# EAGLE design cubo (EAGLE 9.5.0)
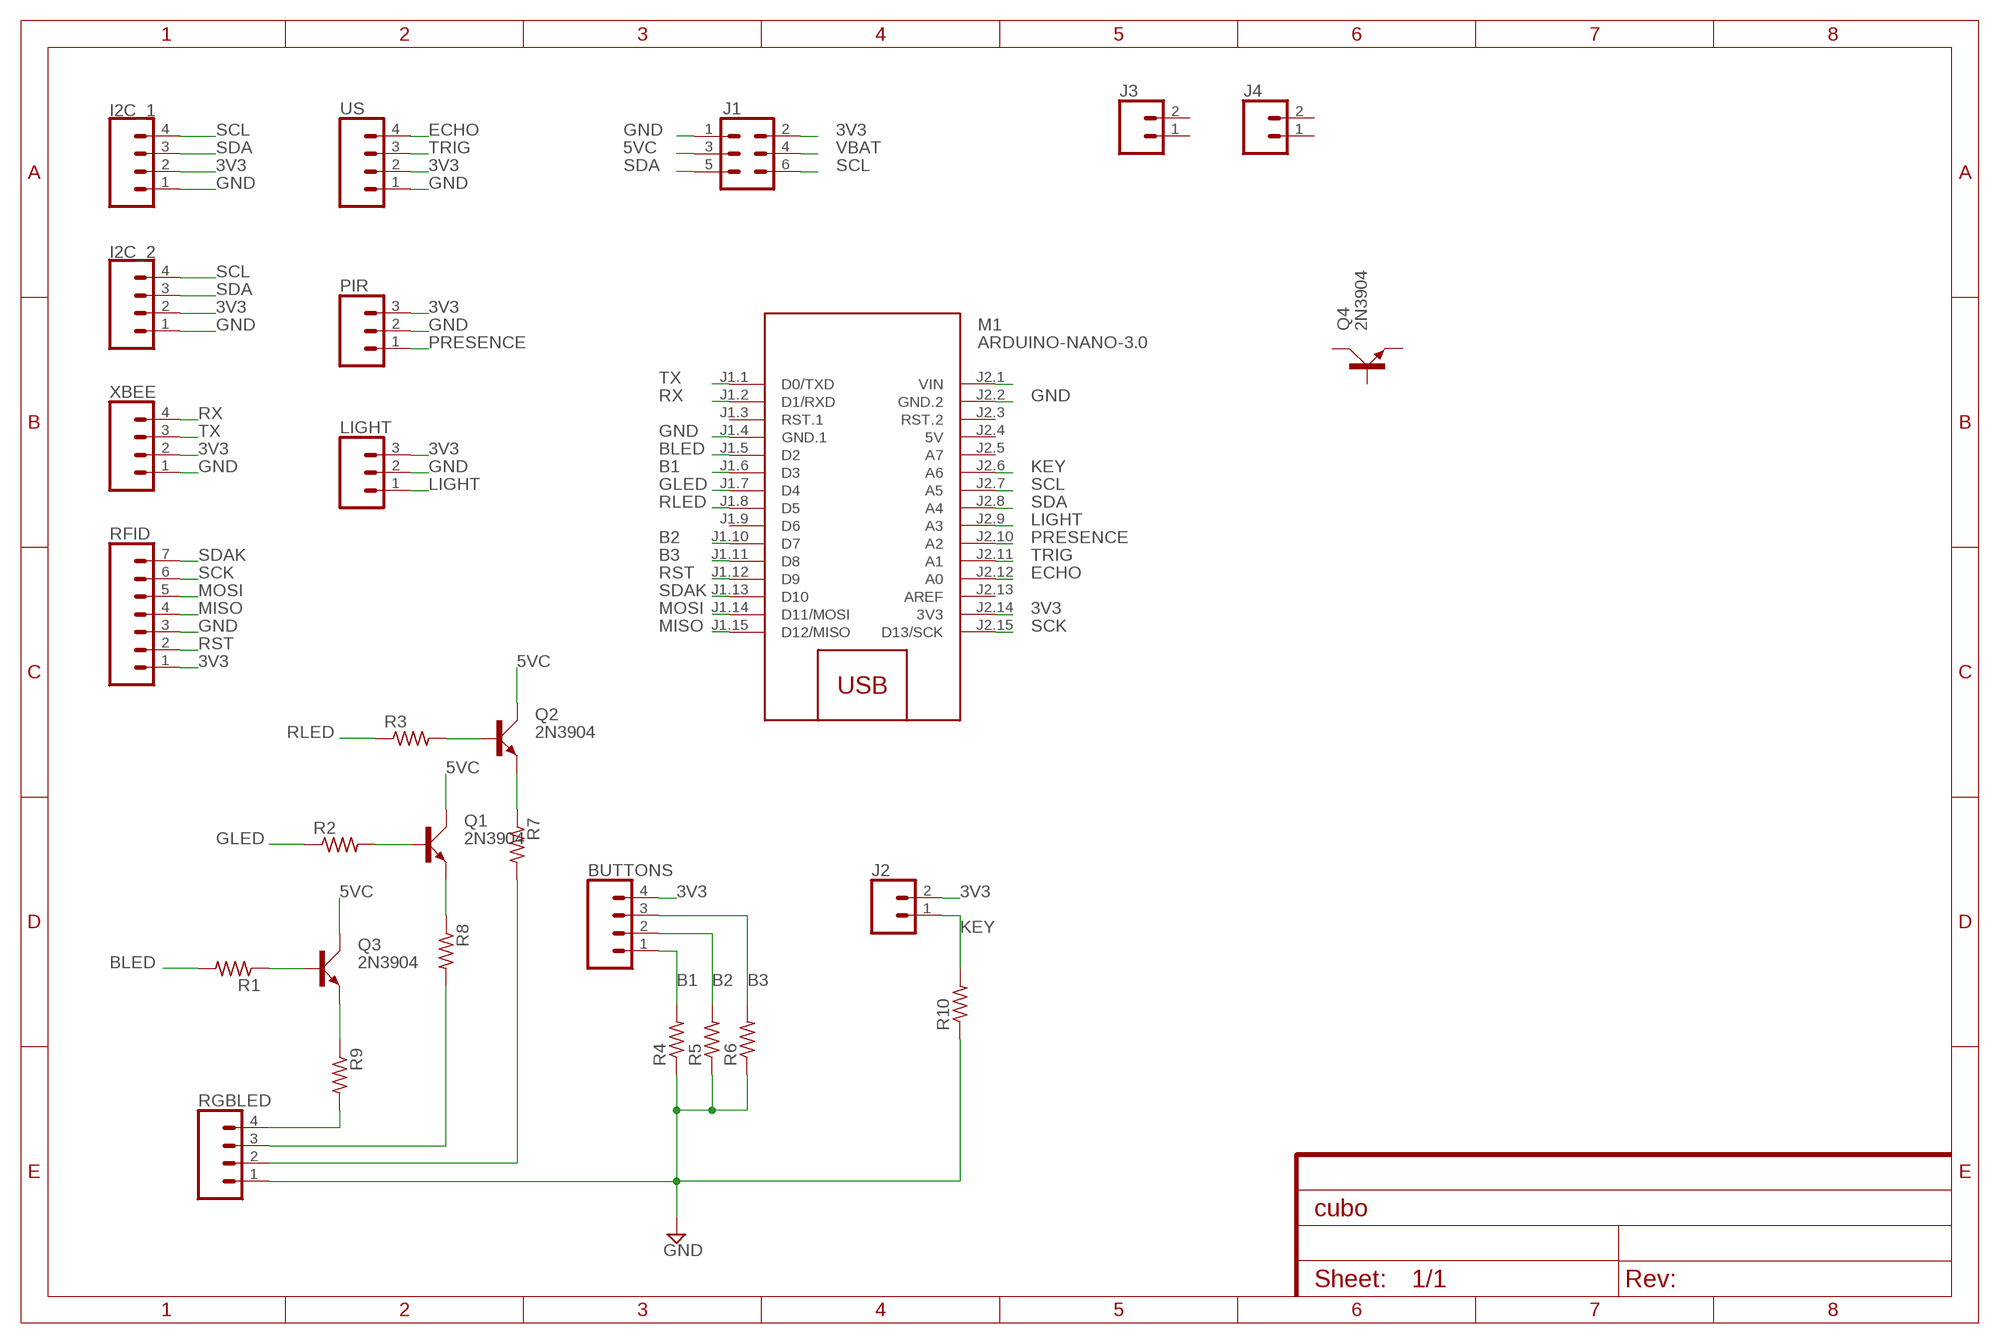
[diagram p0: schematic, sheet 1]

## Parts
BUTTONS  CONN_04JST-PTH-VERT  [JST-4-PTH-VERT]
I2C_1  CONN_04JST-PTH-VERT  [JST-4-PTH-VERT]
I2C_2  CONN_04JST-PTH-VERT  [JST-4-PTH-VERT]
J1  CONN_03X2SHROUD  [2X3-SHROUDED]
J2  CONN_02POLAR_LOCK  [MOLEX-1X2_LOCK]
J3  CONN_02POLAR_LOCK  [MOLEX-1X2_LOCK]
J4  CONN_02POLAR_LOCK  [MOLEX-1X2_LOCK]
LIGHT  CONN_03JST-PTH-VERT  [JST-3-PTH-VERT]
M1  ARDUINO-NANO-3.0  [ARDUINO-NANO-3.0]
PIR  CONN_03JST-PTH-VERT  [JST-3-PTH-VERT]
Q1  2N3904  [TO92D]
Q2  2N3904  [TO92D]
Q3  2N3904  [TO92D]
Q4  2N3904  [TO92D]
R1  R-US_0207/10  [0207/10]
R2  R-US_0207/10  [0207/10]
R3  R-US_0207/10  [0207/10]
R4  R-US_0207/10  [0207/10]
R5  R-US_0207/10  [0207/10]
R6  R-US_0207/10  [0207/10]
R7  R-US_0207/10  [0207/10]
R8  R-US_0207/10  [0207/10]
R9  R-US_0207/10  [0207/10]
R10  R-US_0207/10  [0207/10]
RFID  CONN_07  [1X07]
RGBLED  CONN_04JST-PTH-VERT  [JST-4-PTH-VERT]
US  CONN_04JST-PTH-VERT  [JST-4-PTH-VERT]
XBEE  CONN_04JST-PTH-VERT  [JST-4-PTH-VERT]

## Nets
3V3: BUTTONS.4 I2C_1.2 I2C_2.2 J1.2 J2.2 LIGHT.3 M1.J2.14(3V3) PIR.3 RFID.1 US.2 XBEE.2
5VC: J1.3 Q1.C Q2.C Q3.C
B1: BUTTONS.1 M1.J1.6(D3) R4.2
B2: BUTTONS.2 M1.J1.10(D7) R5.2
B3: BUTTONS.3 M1.J1.11(D8) R6.2
BLED: M1.J1.5(D2) R1.2
ECHO: M1.J2.12(A0) US.4
GLED: M1.J1.7(D4) R2.1
GND: I2C_1.1 I2C_2.1 J1.1 LIGHT.2 M1.J1.4(GND.1) M1.J2.2(GND.2) PIR.2 R4.1 R5.1 R6.1 R10.1 RFID.3 RGBLED.1 US.1 XBEE.1
KEY: J2.1 M1.J2.6(A6) R10.2
LIGHT: LIGHT.1 M1.J2.9(A3)
MISO: M1.J1.15(D12/MISO) RFID.4
MOSI: M1.J1.14(D11/MOSI) RFID.5
N$1: Q2.B R3.2
N$2: Q1.B R2.2
N$3: Q3.B R1.1
N$4: Q3.E R9.1
N$5: Q1.E R8.1
N$6: Q2.E R7.1
N$7: M1.J2.1(VIN)
N$13: R9.2 RGBLED.4
N$14: R8.2 RGBLED.3
N$15: R7.2 RGBLED.2
PRESENCE: M1.J2.10(A2) PIR.1
RLED: M1.J1.8(D5) R3.1
RST: M1.J1.12(D9) RFID.2
RX: M1.J1.2(D1/RXD) XBEE.4
SCK: M1.J2.15(D13/SCK) RFID.6
SCL: I2C_1.4 I2C_2.4 J1.6 M1.J2.7(A5)
SDA: I2C_1.3 I2C_2.3 J1.5 M1.J2.8(A4)
SDAK: M1.J1.13(D10) RFID.7
TRIG: M1.J2.11(A1) US.3
TX: M1.J1.1(D0/TXD) XBEE.3
VBAT: J1.4
Unconnected: J3.1 J3.2 J4.1 J4.2 M1.J1.3(RST.1) M1.J1.9(D6) M1.J2.3(RST.2) M1.J2.5(A7) M1.J2.13(AREF) Q4.B Q4.C Q4.E

## Power pins joined to a net without a drawn wire
5V: M1.J2.4(5V)

## Library data of the parts
BUTTONS I2C_1 I2C_2 RGBLED US XBEE = SparkFun-Connectors:CONN_04: Multi connection point. Often used as Generic Header-pin footprint for 0.1 inch spaced/style header connections On any of the 0.1 inch spaced packages, you can populate with these: Break Away Headers - Straight <https://www.sparkfun.com/products/116> (PRT-00116) Break Away Male Headers - Right Angle <https://www.sparkfun.com/products/553> (PRT-00553) Female Headers <https://www.sparkfun.com/products/115> (PRT-00115) Break Away Headers - Machine Pin <https://www.sparkfun.com/products/117> (PRT-00117) Break Away Female Headers - Swiss Machine Pin <https://www.sparkfun.com/products/743> (PRT-00743) For SCREWTERMINALS and SPRING TERMINALS visit here: Screw Terimnals on SparkFun.com <https://www.sparkfun.com/search/results?term=Screw+Terminals> (5mm/3.5mm/2.54mm spacing) This device is also useful as a general connection point to wire up your design to another part of your project. Our various solder wires solder well into these plated through hole pads. Hook-Up Wire - Assortment (Stranded, 22 AWG) <https://www.sparkfun.com/products/11375> (PRT-11375) Hook-Up Wire - Assortment (Solid Core, 22 AWG) <https://www.sparkfun.com/products/11367> (PRT-11367) View the entire wire category on our website here <https://www.sparkfun.com/categories/141> Special notes: Molex polarized connector foot print use with SKU : PRT-08231 with associated crimp pins and housings. 1MM SMD Version SKU: PRT-10208; PROD_ID: CONN-13251
J1 = SparkFun-Connectors:CONN_03X2: Multi connection point. Often used as Generic Header-pin footprint for 0.1 inch spaced/style header connections You can populate with any combo of single row headers, but if you'd like an exact match, check these: Header - 2x3 (Male, 0.1") <https://www.sparkfun.com/products/12807> (PRT-12807) Header - 2x3 (Female, 0.1") <https://www.sparkfun.com/products/13010> (PRT-13010) 2x3 Pin Shrouded Header <https://www.sparkfun.com/products/10877> (PRT-10877) On any of the 0.1 inch spaced packages, you can populate with these: Break Away Headers - Straight <https://www.sparkfun.com/products/116> (PRT-00116) Break Away Male Headers - Right Angle <https://www.sparkfun.com/products/553> (PRT-00553) Female Headers <https://www.sparkfun.com/products/115> (PRT-00115) Break Away Headers - Machine Pin <https://www.sparkfun.com/products/117> (PRT-00117) Break Away Female Headers - Swiss Machine Pin <https://www.sparkfun.com/products/743> (PRT-00743) Special note: the shrouded connector mates well with our 3x2 ribbon cables: Ribbon Crimp Connector - 6-pin (2x3, Female) <https://www.sparkfun.com/products/10651> (PRT-10651) Ribbon Cable - 6 wire (15ft) <https://www.sparkfun.com/products/10646> (PRT-10646); PROD_ID: CONN-10681; SF_ID: PRT_10877
J2-J4 = SparkFun-Connectors:CONN_02: Multi connection point. Often used as Generic Header-pin footprint for 0.1 inch spaced/style header connections On any of the 0.1 inch spaced packages, you can populate with these: Break Away Headers - Straight <https://www.sparkfun.com/products/116> (PRT-00116) Break Away Male Headers - Right Angle <https://www.sparkfun.com/products/553> (PRT-00553) Female Headers <https://www.sparkfun.com/products/115> (PRT-00115) Break Away Headers - Machine Pin <https://www.sparkfun.com/products/117> (PRT-00117) Break Away Female Headers - Swiss Machine Pin <https://www.sparkfun.com/products/743> (PRT-00743) For SCREWTERMINALS and SPRING TERMINALS visit here: Screw Terimnals on SparkFun.com <https://www.sparkfun.com/search/results?term=Screw+Terminals> (5mm/3.5mm/2.54mm spacing) This device is also useful as a general connection point to wire up your design to another part of your project. Our various solder wires solder well into these plated through hole pads. Hook-Up Wire - Assortment (Stranded, 22 AWG) <https://www.sparkfun.com/products/11375> (PRT-11375) Hook-Up Wire - Assortment (Solid Core, 22 AWG) <https://www.sparkfun.com/products/11367> (PRT-11367) View the entire wire category on our website here <https://www.sparkfun.com/categories/141> Special notes: Molex polarized connector foot print use with: PRT-08233 with associated crimp pins and housings. 2.54_SCREWTERM for use with PRT-10571. 3.5mm Screw Terminal footprints for PRT-08084 5mm Screw Terminal footprints for use with PRT-08432; SF_ID: PRT-09918
LIGHT PIR = SparkFun-Connectors:CONN_03: Multi connection point. Often used as Generic Header-pin footprint for 0.1 inch spaced/style header connections On any of the 0.1 inch spaced packages, you can populate with these: Break Away Headers - Straight <https://www.sparkfun.com/products/116> (PRT-00116) Break Away Male Headers - Right Angle <https://www.sparkfun.com/products/553> (PRT-00553) Female Headers <https://www.sparkfun.com/products/115> (PRT-00115) Break Away Headers - Machine Pin <https://www.sparkfun.com/products/117> (PRT-00117) Break Away Female Headers - Swiss Machine Pin <https://www.sparkfun.com/products/743> (PRT-00743) Stackable Header - 3 Pin (Female, 0.1") <https://www.sparkfun.com/products/13875> (PRT-13875) For SCREWTERMINALS and SPRING TERMINALS visit here: Screw Terimnals on SparkFun.com <https://www.sparkfun.com/search/results?term=Screw+Terminals> (5mm/3.5mm/2.54mm spacing) This device is also useful as a general connection point to wire up your design to another part of your project. Our various solder wires solder well into these plated through hole pads. Hook-Up Wire - Assortment (Stranded, 22 AWG) <https://www.sparkfun.com/products/11375> (PRT-11375) Hook-Up Wire - Assortment (Solid Core, 22 AWG) <https://www.sparkfun.com/products/11367> (PRT-11367) View the entire wire category on our website here <https://www.sparkfun.com/categories/141> Special notes: Molex polarized connector foot print use with SKU : PRT-08232 with associated crimp pins and housings.; PROD_ID: CONN-13230
M1 = diy-modules:ARDUINO-NANO-3.0: Arduino Nano 3.0
Q1-Q4 = transistor-small-signal:2N3904: NPN TRANSISTOR
R1-R10 = BeagleBone_Black_Wireless:R-US_: RESISTOR, American symbol
RFID = SparkFun-Connectors:CONN_07: Multi connection point. Often used as Generic Header-pin footprint for 0.1 inch spaced/style header connections On any of the 0.1 inch spaced packages, you can populate with these: Break Away Headers - Straight <https://www.sparkfun.com/products/116> (PRT-00116) Break Away Male Headers - Right Angle <https://www.sparkfun.com/products/553> (PRT-00553) Female Headers <https://www.sparkfun.com/products/115> (PRT-00115) Break Away Headers - Machine Pin <https://www.sparkfun.com/products/117> (PRT-00117) Break Away Female Headers - Swiss Machine Pin <https://www.sparkfun.com/products/743> (PRT-00743) For SCREWTERMINALS and SPRING TERMINALS visit here: Screw Terimnals on SparkFun.com <https://www.sparkfun.com/search/results?term=Screw+Terminals> (5mm/3.5mm/2.54mm spacing) This device is also useful as a general connection point to wire up your design to another part of your project. Our various solder wires solder well into these plated through hole pads. Hook-Up Wire - Assortment (Stranded, 22 AWG) <https://www.sparkfun.com/products/11375> (PRT-11375) Hook-Up Wire - Assortment (Solid Core, 22 AWG) <https://www.sparkfun.com/products/11367> (PRT-11367) View the entire wire category on our website here <https://www.sparkfun.com/categories/141> Special notes: Molex polarized connector foot print use with SKU : PRT-08231 with associated crimp pins and housings. 1MM SMD Version SKU: PRT-10208 NOTES ON THE VARIANTS LOCK and LOCK_LONGPADS... This footprint was designed to help hold the alignment of a through-hole component (i.e. 6-pin header) while soldering it into place. You may notice that each hole has been shifted either up or down by 0.005 of an inch from it's more standard position (which is a perfectly straight line). This slight alteration caused the pins (the squares in the middle) to touch the edges of the holes. Because they are alternating, it causes a "brace" to hold the component in place. 0.005 has proven to be the perfect amount of "off-center" position when using our standard breakaway headers. Although looks a little odd when you look at the bare footprint, once you have a header in there, the alteration is very hard to notice. Also,if you push a header all the way into place, it is covered up entirely on the bottom side.

## Board
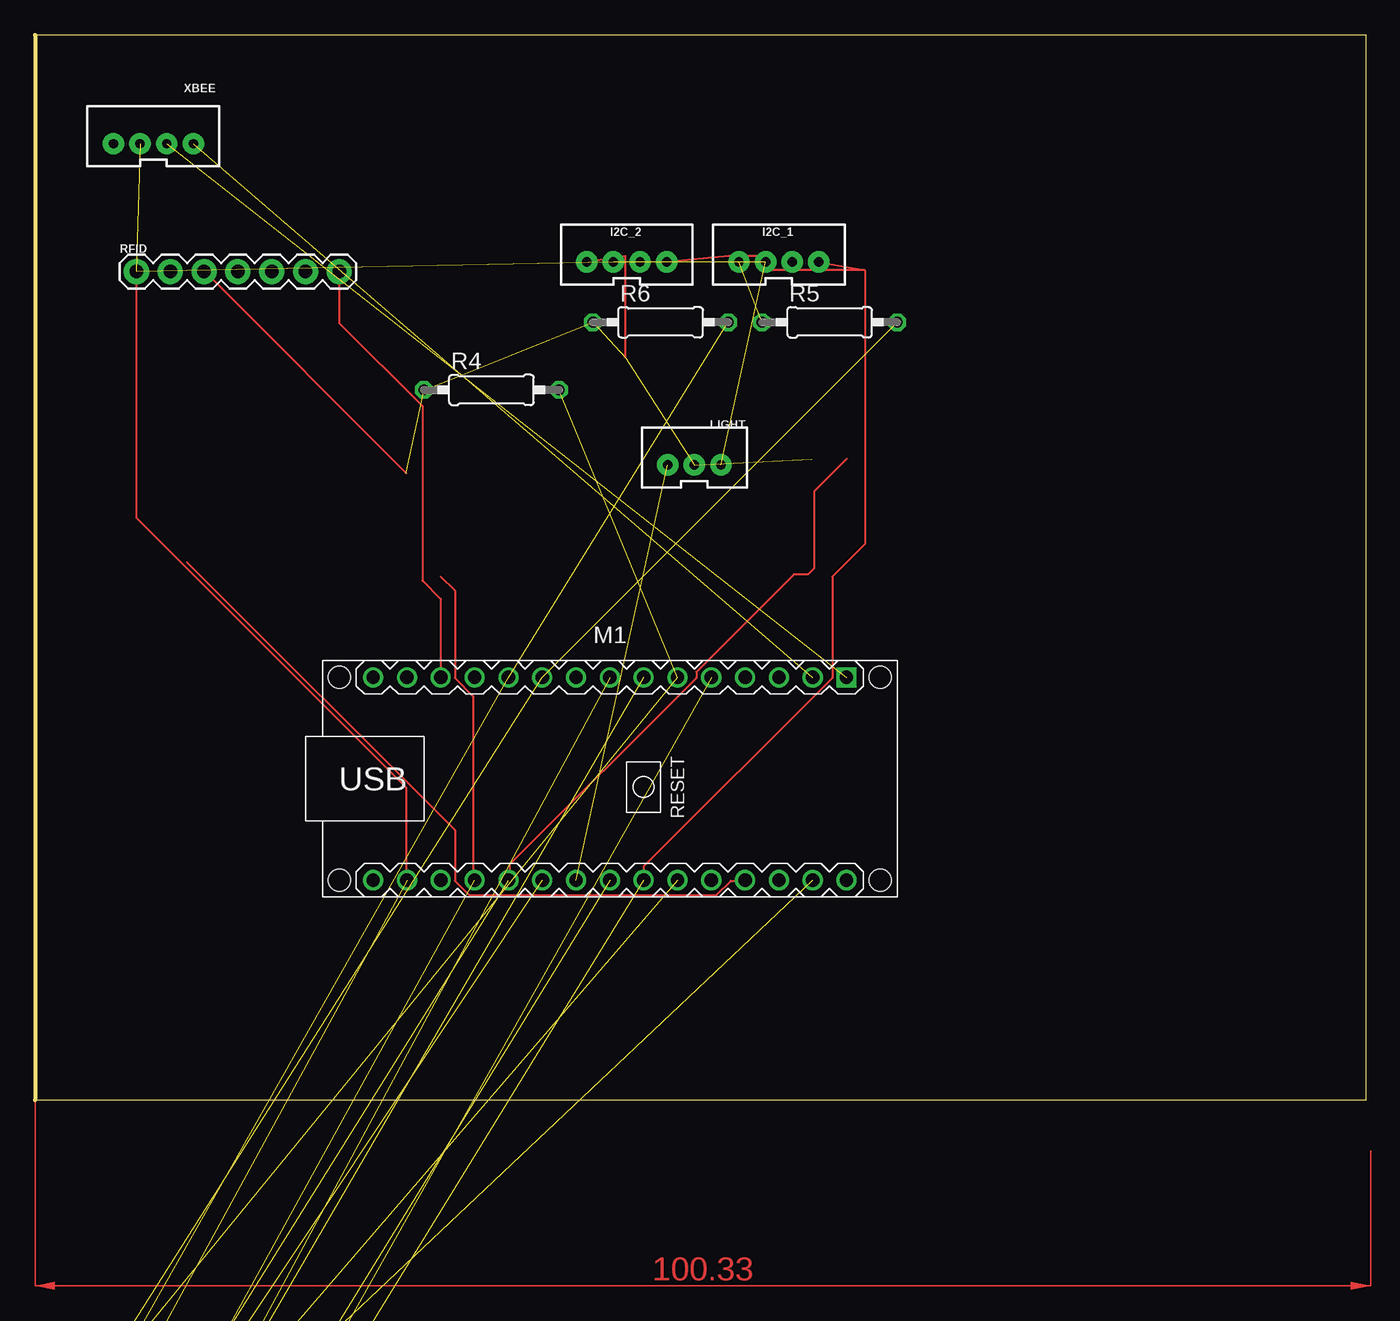
[diagram p1: board, top side]
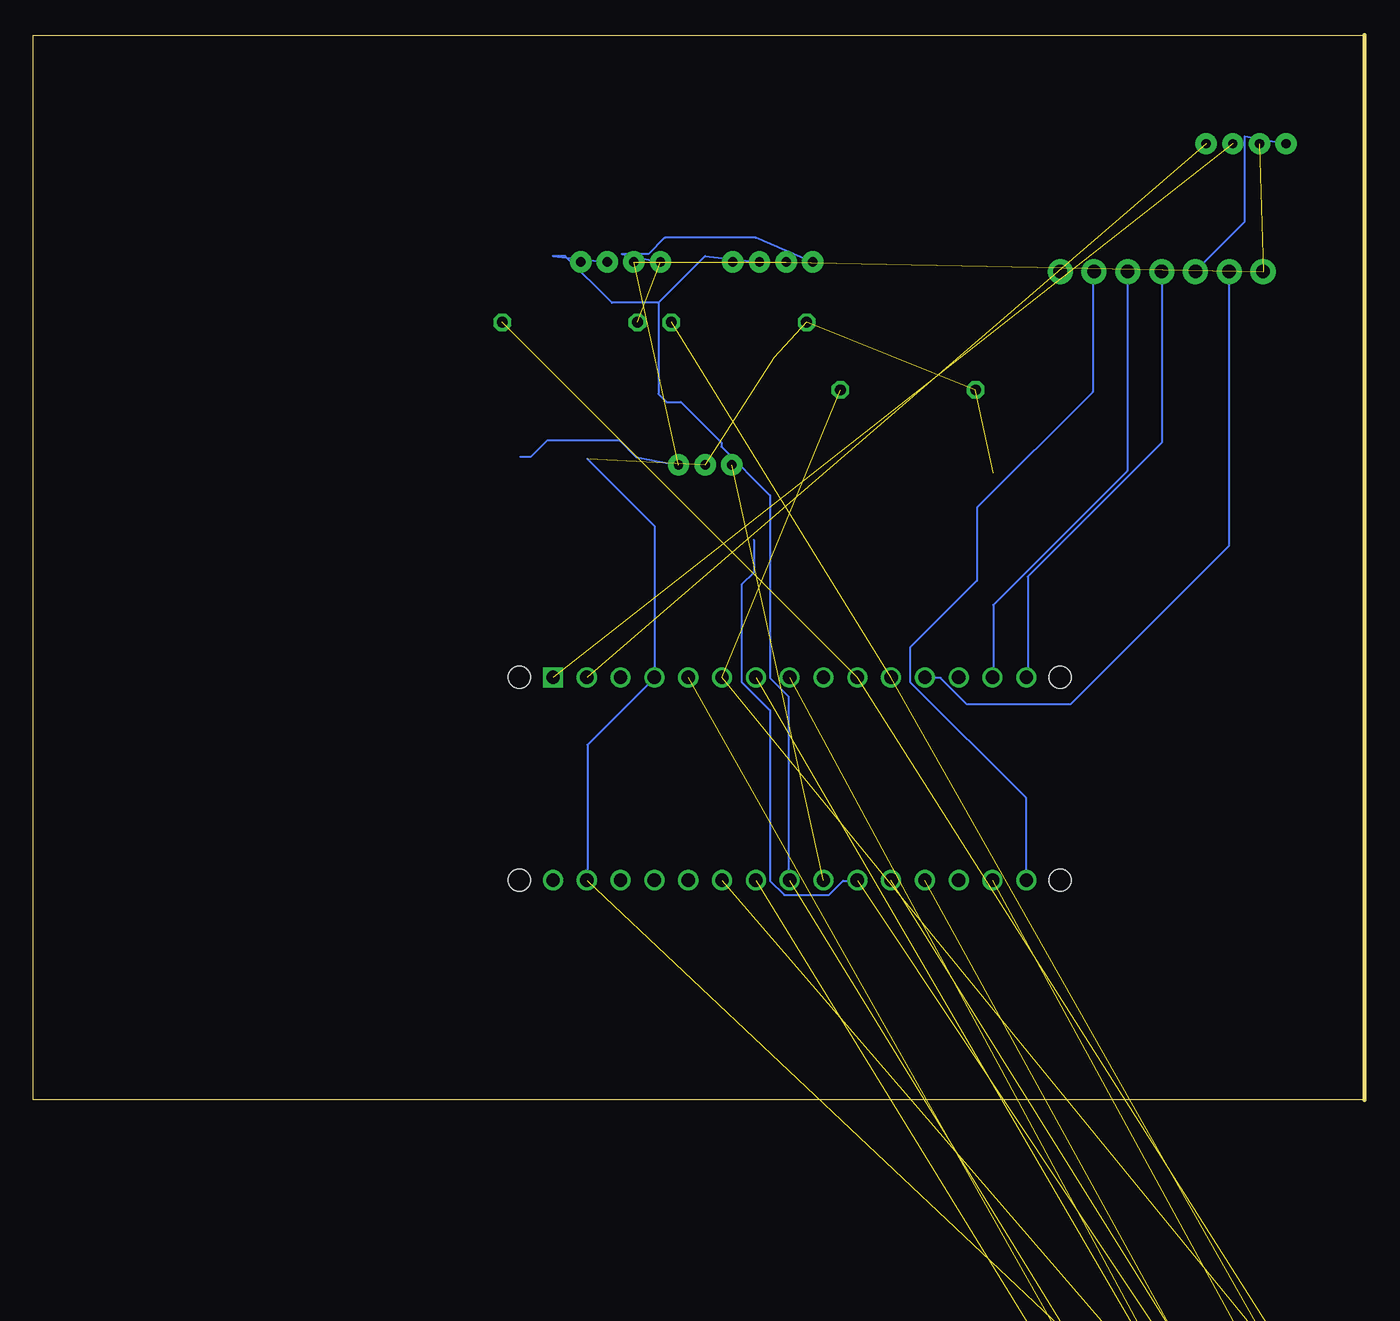
[diagram p2: board, bottom side, seen from below]

Size 100 x 80 mm. Coordinates in mm from the lower left corner, seen from the top.
Outline: 0,0 100,0 100,80 0,80 0,0
Copper layers (1*16): Top 0.035mm / dielectric 1.5mm / Bottom 0.035mm
Design rules "default": minimum track width 6mil, minimum drill 0.35mm, track to track 6mil, track to pad 6mil, pad to pad 6mil, via to via 6mil, smd to smd 6mil, copper to edge 40mil, drill to drill 6mil, minimum pad ring 10mil, minimum via ring 8mil, stop-mask expansion 4mil, vias tented up to drill 0mil, thermal gap 10mil

### Footprints (pad centres in the part's own frame; a part is rotated, then mirrored left to right if it is on the bottom)
JST-4-PTH-VERT = drill 0.7 pad 1.6: 1 -3,-0.55; 2 -1,-0.55; 3 1,-0.55; 4 3,-0.55
2X3-SHROUDED = drill 1.016 pad 1.88: 1 -1.27,2.54; 2 1.27,2.54; 3 -1.27,0; 4 1.27,0; 5 -1.27,-2.54; 6 1.27,-2.54
MOLEX-1X2_LOCK = drill 1.016 pad 1.88 square: 1 -0.127,0 | drill 1.016 pad 1.88: 2 2.667,0
JST-3-PTH-VERT = drill 0.7 pad 1.6: 1 -2,-0.55; 2 0,-0.55; 3 2,-0.55
ARDUINO-NANO-3.0 = drill 1 square: J1.1 17.78,7.62 | drill 1: J1.2 15.24,7.62; J1.3 12.7,7.62; J1.4 10.16,7.62; J1.5 7.62,7.62; J1.6 5.08,7.62; J1.7 2.54,7.62; J1.8 0,7.62; J1.9 -2.54,7.62; J1.10 -5.08,7.62; J1.11 -7.62,7.62; J1.12 -10.16,7.62; J1.13 -12.7,7.62; J1.14 -15.24,7.62; J1.15 -17.78,7.62; J2.1 17.78,-7.62; J2.2 15.24,-7.62; J2.3 12.7,-7.62; J2.4 10.16,-7.62; J2.5 7.62,-7.62; J2.6 5.08,-7.62; J2.7 2.54,-7.62; J2.8 0,-7.62; J2.9 -2.54,-7.62; J2.10 -5.08,-7.62; J2.11 -7.62,-7.62; J2.12 -10.16,-7.62; J2.13 -12.7,-7.62; J2.14 -15.24,-7.62; J2.15 -17.78,-7.62 | hole 1.651: -20.32,7.62; -20.32,-7.62; 20.32,-7.62; 20.32,7.62
TO92D = drill 0.813 octagon: B 0,1.905; C 1.27,0; E -1.27,0
0207/10 = drill 0.813 octagon: 1 -5.08,0; 2 5.08,0
1X07 = drill 1.016 pad 1.88: 1 0,0; 2 2.54,0; 3 5.08,0; 4 7.62,0; 5 10.16,0; 6 12.7,0; 7 15.24,0

### Placement (x,y rotation side)
BUTTONS  -3,-34.12 0 top  (outside the outline)
I2C_1  55.88,63.5 0 top
I2C_2  44.45,63.5 0 top
J1  -34.29,-109.22 0 top  (outside the outline)
J2  -13.97,-55.88 0 top  (outside the outline)
J3  -20.32,-55.88 0 top  (outside the outline)
J4  -26.67,-55.88 0 top  (outside the outline)
LIGHT  49.53,48.26 0 top
M1  43.18,24.13 0 top
PIR  -5.08,-50.8 0 top  (outside the outline)
Q1  -25.4,-63.5 0 top  (outside the outline)
Q2  -25.4,-69.85 0 top  (outside the outline)
Q3  -25.4,-76.2 0 top  (outside the outline)
Q4  -25.4,-82.55 0 top  (outside the outline)
R1  -21.59,-87.63 0 top  (outside the outline)
R2  -21.59,-92.71 0 top  (outside the outline)
R3  -21.59,-97.79 0 top  (outside the outline)
R4  34.29,53.34 0 top
R5  59.69,58.42 0 top
R6  46.99,58.42 0 top
R7  -21.59,-102.87 0 top  (outside the outline)
R8  -21.59,-107.95 0 top  (outside the outline)
R9  -21.59,-113.03 0 top  (outside the outline)
R10  -21.59,-118.11 0 top  (outside the outline)
RFID  7.62,62.23 0 top
RGBLED  -3.81,-57.15 0 top  (outside the outline)
US  -3.81,-44.45 0 top  (outside the outline)
XBEE  8.89,72.39 0 top

### Tracks (layer width: path | path; a pad name or v marks a point on that pad's centre or on a via)
3V3  (9 unrouted)
  Top 0.152: RFID.1 7.62,43.74 27.89,23.47 27.89,16.61 M1.J2.14
  Bottom 0.152: 63.4,48.31 62.64,48.31 61.42,49.53 55.93,49.53 54.71,48.31 LIGHT.3
5V
  Top 0.152: 11.43,40.39 31.55,20.27 31.55,16.46 32.61,15.39 51.21,15.39 52.27,16.46 53.34,16.46 M1.J2.4
5VC  (3 unrouted)
B1  (2 unrouted)
B2  (2 unrouted)
B3  (2 unrouted)
BLED  (1 unrouted)
ECHO  (1 unrouted)
  Top 0.152: 30.48,39.32 31.55,38.25 31.55,31.7 32.92,30.33 32.92,16.61 M1.J2.12
GLED  (1 unrouted)
GND  (11 unrouted)
  Top 0.152: 44.35,55.78 44.35,63.4 I2C_2.1 | 27.89,47.09 12.8,62.18 RFID.3
  Bottom 0.152: M1.J2.2 58.37,16.61 58.37,26.67 53.34,31.7 M1.J1.4 53.34,43.13 58.37,48.16 | I2C_2.1 45.72,64.77 52.58,64.77 53.8,63.55 55.78,63.55 I2C_1.1 | XBEE.1 8.99,72.39 8.99,65.99 12.65,62.33 RFID.3
KEY  (2 unrouted)
LIGHT  (1 unrouted)
MISO
  Bottom 0.152: RFID.4 15.24,49.38 25.3,39.32 25.3,31.85 M1.J1.15
MOSI
  Bottom 0.152: M1.J1.14 27.89,31.85 27.89,37.19 17.83,47.24 17.83,62.18 RFID.5
N$1  (1 unrouted)
N$2  (1 unrouted)
N$3  (1 unrouted)
N$4  (1 unrouted)
N$5  (1 unrouted)
N$6  (1 unrouted)
N$13  (1 unrouted)
N$14  (1 unrouted)
N$15  (1 unrouted)
PRESENCE  (1 unrouted)
  Bottom 0.152: 45.87,42.06 45.87,39.62 46.79,38.71 46.79,31.39 44.65,29.26 44.65,16.46 43.59,15.39 40.23,15.39 39.17,16.46 38.1,16.46 M1.J2.10
RLED  (1 unrouted)
RST
  Bottom 0.152: M1.J1.12 32.92,31.7 31.85,31.7 29.87,29.72 22.1,29.72 10.21,41.6 10.21,62.18 RFID.2
RX  (1 unrouted)
SCK
  Bottom 0.152: M1.J2.15 25.45,16.61 25.45,22.71 34.14,31.39 34.14,33.98 29.11,39.01 29.11,44.5 20.42,53.19 20.42,62.18 RFID.6
SCL  (1 unrouted)
  Top 0.152: M1.J2.7 45.72,17.53 59.89,31.7 59.89,39.32 62.33,41.76 62.33,62.33 | I2C_1.4 62.33,62.33 | 62.33,62.33 55.32,62.33 54.25,63.4 52.12,63.4 I2C_2.4
SDA  (1 unrouted)
  Bottom 0.152: 53.03,59.89 53.03,53.03 52.43,52.43 51.36,52.43 48.31,49.38 48.31,49.07 44.65,45.41 44.65,31.7 43.28,30.33 43.28,16.61 M1.J2.8 | 53.03,59.89 49.53,63.4 I2C_2.3 | 53.03,59.89 56.54,59.89 60.05,63.4 60.96,63.4 I2C_1.3
SDAK
  Top 0.152: M1.J1.13 30.48,37.64 29.11,39.01 29.11,52.12 22.86,58.37 RFID.7
TRIG  (1 unrouted)
  Top 0.152: 60.96,48.16 58.52,45.72 58.52,39.93 58.06,39.47 57,39.47 49.68,32.16 49.68,31.7 35.66,17.68 35.66,16.61 M1.J2.11
TX  (1 unrouted)
(copper drawn outside any net)
  shapes: Top area x2